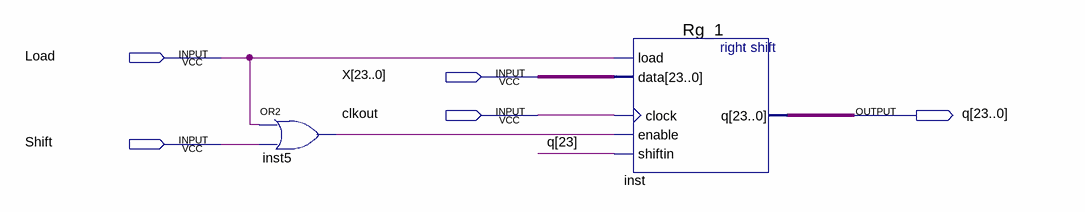
[diagram p0: schematic sheet]
// Quartus schematic Rg1.bdf as structural Verilog: 2 symbols, 5 pins
module Rg1 (
  input  Load,
  input  [23:0] X,
  input  clkout,
  input  Shift,
  output [23:0] q
);

  wire inst5_out;

  or inst5 (inst5_out, Load, Shift);
  Rg_1 inst (.load(Load), .data(X), .clock(clkout), .enable(inst5_out), .shiftin(q[23]), .q(q));
endmodule
